# EAGLE design rf_switch (EAGLE 6.6.0)

## Sheet 1 of 2
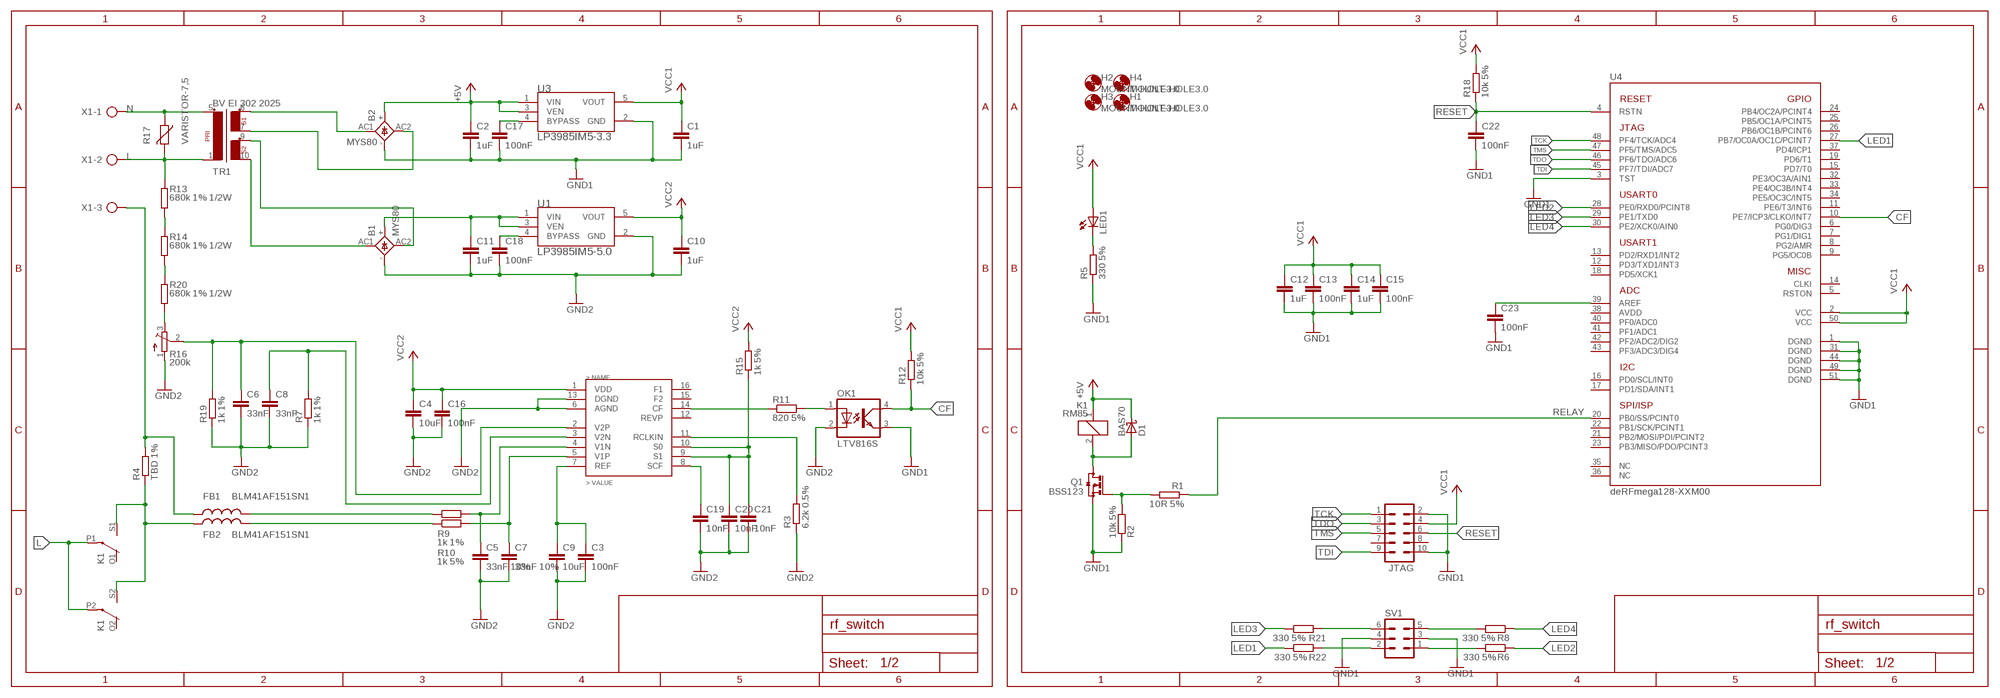
[diagram p0: schematic, sheet 1]

### Parts
B1  MYS80  [MICRODIL]
B2  MYS80  [MICRODIL]
C1  1uF  C-EUC0603  [C0603]
C2  1uF  C-EUC0603  [C0603]
C3  100nF  C-EUC0603  [C0603]
C4  10uF  C-EUC0805  [C0805]
C5  33nF 10%  C-EUC0805  [C0805]
C6  33nF  C-EUC0603  [C0603]
C7  33nF 10%  C-EUC0805  [C0805]
C8  33nF  C-EUC0603  [C0603]
C9  10uF  C-EUC0805  [C0805]
C10  1uF  C-EUC0603  [C0603]
C11  1uF  C-EUC0603  [C0603]
C12  1uF  C-EUC0603  [C0603]
C13  100nF  C-EUC0603  [C0603]
C14  1uF  C-EUC0603  [C0603]
C15  100nF  C-EUC0603  [C0603]
C16  100nF  C-EUC0603  [C0603]
C17  100nF  C-EUC0603  [C0603]
C18  100nF  C-EUC0603  [C0603]
C19  10nF  C-EUC0603  [C0603]
C20  10nF  C-EUC0603  [C0603]
C21  10nF  C-EUC0603  [C0603]
C22  100nF  C-EUC0603  [C0603]
C23  100nF  C-EUC0603  [C0603]
D1  BAS70  [SOT23]
FB1  BLM41AF151SN1  FERRITE-BEAD  [1806]
FB2  BLM41AF151SN1  FERRITE-BEAD  [1806]
H1  MOUNT-HOLE3.0  [3,0]
H2  MOUNT-HOLE3.0  [3,0]
H3  MOUNT-HOLE3.0  [3,0]
H4  MOUNT-HOLE3.0  [3,0]
JTAG  MA05-2  [MA05-2]
K1  RM85  4052  [F4052]
LED1  LEDSML0603  [SML0603]
OK1  LTV816S  [SMD4]
Q1  BSS123  [SOT23]
R1  10R 5%  R-EU_R0603  [R0603]
R2  10k 5%  R-EU_R0603  [R0603]
R3  6.2k 0.5%  R-EU_R0603  [R0603]
R4  TBD 1%  R-EU_R1206  [R1206]
R5  330 5%  R-EU_R0603  [R0603]
R6  330 5%  R-EU_R0603  [R0603]
R7  1k 1%  R-EU_R0603  [R0603]
R8  330 5%  R-EU_R0603  [R0603]
R9  1k 1%  R-EU_R1206  [R1206]
R10  1k 5%  R-EU_R1206  [R1206]
R11  820 5%  R-EU_R0603  [R0603]
R12  10k 5%  R-EU_R0603  [R0603]
R13  680k 1% 1/2W  R-EU_R1206  [R1206]
R14  680k 1% 1/2W  R-EU_R1206  [R1206]
R15  1k 5%  R-EU_R0603  [R0603]
R16  200k  TRIM_EU-3223W  [3223W]
R17  VARISTOR-7,5  [R-7,5]
R18  10k 5%  R-EU_R0603  [R0603]
R19  1k 1%  R-EU_R0603  [R0603]
R20  680k 1% 1/2W  R-EU_R1206  [R1206]
R21  330 5%  R-EU_R0603  [R0603]
R22  330 5%  R-EU_R0603  [R0603]
SV1  MA03-2  [MA03-2]
TR1  BV EI 302 2025  EI30-2  [EI30-2]
U1  LP3985IM5-5.0  LP3985IM5-3.3  [SOT95P300X120-5N]
U2  ADE7757  [SOIC-16]
U3  LP3985IM5-3.3  [SOT95P300X120-5N]
U4  DERFMEGA128-XXM00  [A-M00]
X1  AK500/3  [AK500/3]

### Nets
+5V: B2.+ C2.1 D1.3(C) K1.1 U3.1(VIN) U3.3(VEN)
CF: OK1.4(COL) R12.1 U4.10(PE7/ICP3/CLKO/INT7)
CF1: C20.1 C21.1 R15.1 U2.9(S1) U2.10(S0)
COMMON: FB1.P$1 R4.2 X1.3
GND1: B2.- C1.2 C2.2 C12.2 C13.2 C14.2 C15.2 C17.2 C22.2 C23.2 JTAG.2 JTAG.10 OK1.3(EMIT) Q1.2(S) R2.1 R5.1 SV1.3 SV1.4 U3.2(GND) U4.1(DGND) U4.3(TST) U4.31(DGND) U4.44(DGND) U4.49(DGND) U4.51(DGND)
GND2: B1.- C3.2 C4.2 C5.2 C6.2 C7.2 C8.2 C9.2 C10.2 C11.2 C16.2 C18.2 C19.2 C20.2 C21.2 OK1.2(C) R3.1 R7.1 R16.1(A) R19.1 U1.2(GND) U2.6(AGND) U2.13(DGND)
L: K1.P1(2:P) K1.P2(3:P) R13.1 R17.2 TR1.1 X1.2
LED1: R22.1 U4.27(PB7/OC0A/OC1C/PCINT7)
LED2: R6.1 U4.28(PE0/RXD0/PCINT8)
LED3: R21.1 U4.29(PE1/TXD0)
LED4: R8.1 U4.30(PE2/XCK0/AIN0)
N: R17.1 TR1.5 X1.1
N$1: Q1.1(G) R1.2 R2.2
N$2: B1.+ C11.1 U1.1(VIN) U1.3(VEN)
N$3: R11.1 U2.14(CF)
N$4: R13.2 R14.1
N$5: OK1.1(A) R11.2
N$6: D1.1(A) K1.2 Q1.3(D)
N$7: R14.2 R20.1
N$8: R3.2 U2.11(RCLKIN)
N$9: C19.1 U2.8(SCF)
N$10: FB1.P$2 R9.1
N$11: R16.3(E) R20.2
N$12: C3.1 C9.1 U2.7(REF)
N$13: B2.AC2 TR1.7
N$14: C23.1 U4.39(AREF)
N$15: FB2.P$1 K1.S1(2:S) K1.S2(3:S) R4.1
N$16: FB2.P$2 R10.1
N$17: B1.AC1 TR1.10
N$18: B1.AC2 TR1.9
N$19: R8.2 SV1.5
N$20: B2.AC1 TR1.6
N$23: LED1.C R5.2
N$24: C17.1 U3.4(BYPASS)
N$25: C18.1 U1.4(BYPASS)
N$26: R21.2 SV1.6
N$27: R22.2 SV1.2
N$28: R6.2 SV1.1
RELAY: R1.1 U4.20(PB0/SS/PCINT0)
RESET: C22.1 JTAG.6 R18.1 U4.4(RSTN)
TCK: JTAG.1 U4.48(PF4/TCK/ADC4)
TDI: JTAG.9 U4.45(PF7/TDI/ADC7)
TDO: JTAG.3 U4.46(PF6/TDO/ADC6)
TMS: JTAG.5 U4.47(PF5/TMS/ADC5)
V1N: C5.1 R9.2 U2.4(V1N)
V1P: C7.1 R10.2 U2.5(V1P)
V2N: C8.1 R7.2 U2.3(V2N)
V2P: C6.1 R16.2(S) R19.2 U2.2(V2P)
VCC1: C1.1 C12.1 C13.1 C14.1 C15.1 JTAG.4 LED1.A R12.2 R18.2 U3.5(VOUT) U4.2(VCC) U4.50(VCC)
VCC2: C4.1 C10.1 C16.1 R15.2 U1.5(VOUT) U2.1(VDD)
Unconnected: JTAG.7 JTAG.8 K1.O1(2:O) K1.O2(3:O) U2.12(REVP) U2.15(F2) U2.16(F1) U4.5(RSTON) U4.6(PG0/DIG3) U4.7(PG1/DIG1) U4.8(PG2/AMR) U4.9(PG5/OC0B) U4.11(PE6/T3/INT6) U4.12(PD3/TXD1/INT3) U4.13(PD2/RXD1/INT2) U4.14(CLKI) U4.15(PD7/T0) U4.16(PD0/SCL/INT0) U4.17(PD1/SDA/INT1) U4.18(PD5/XCK1) U4.19(PD6/T1) U4.21(PB2/MOSI/PDI/PCINT2) U4.22(PB1/SCK/PCINT1) U4.23(PB3/MISO/PDO/PCINT3) U4.24(PB4/OC2A/PCINT4) U4.25(PB5/OC1A/PCINT5) U4.26(PB6/OC1B/PCINT6) U4.32(PE3/OC3A/AIN1) U4.33(PE4/OC3B/INT4) U4.34(PE5/OC3C/INT5) U4.35(NC) U4.36(NC) U4.37(PD4/ICP1) U4.38(AVDD) U4.40(PF0/ADC0) U4.41(PF1/ADC1) U4.42(PF2/ADC2/DIG2) U4.43(PF3/ADC3/DIG4)

## Sheet 2 of 2

## Library data of the parts
B1 B2 = WB:MYS80: DIOTEC SEMICONDUCTOR
C1-C23 = rcl:C-EU: CAPACITOR, European symbol
D1 = diode:BAS70: Silicon Schottky Diodes General-purpose diode for high-speed switching
FB1 FB2 = WB:FERRITE-BEAD
H1-H4 = holes:MOUNT-HOLE: MOUNTING HOLE with drill center marker
JTAG = con-lstb:MA05-2: PIN HEADER; OC_FARNELL: unknown; OC_NEWARK: unknown
K1 = relay:4052: RELAY 2 x switch, Finder; OC_FARNELL: unknown; OC_NEWARK: unknown
LED1 = led:LED: LED OSRAM: - CHIPLED LG R971, LG N971, LY N971, LG Q971, LY Q971, LO R971, LY R971 LH N974, LH R974 LS Q976, LO Q976, LY Q976 LO Q996 - Hyper CHIPLED LW Q18S LB Q993, LB Q99A, LB R99A - SideLED LS A670, LO A670, LY A670, LG A670, LP A670 LB A673, LV A673, LT A673, LW A673 LH A674 LY A675 LS A676, LA A676, LO A676, LY A676, LW A676 LS A679, LY A679, LG A679 - Hyper Micro SIDELED® LS Y876, LA Y876, LO Y876, LY Y876 LT Y87S - SmartLED LW L88C, LW L88S LB L89C, LB L89S, LG L890 LS L89K, LO L89K, LY L89K LS L896, LA L896, LO L896, LY L896 - TOPLED LS T670, LO T670, LY T670, LG T670, LP T670 LSG T670, LSP T670, LSY T670, LOP T670, LYG T670 LG T671, LOG T671, LSG T671 LB T673, LV T673, LT T673, LW T673 LH T674 LS T676, LA T676, LO T676, LY T676, LB T676, LH T676, LSB T676, LW T676 LB T67C, LV T67C, LT T67C, LS T67K, LO T67K, LY T67K, LW E67C LS E67B, LA E67B, LO E67B, LY E67B, LB E67C, LV E67C, LT E67C LW T67C LS T679, LY T679, LG T679 LS T770, LO T770, LY T770, LG T770, LP T770 LB T773, LV T773, LT T773, LW T773 LH T774 LS E675, LA E675, LY E675, LS T675 LS T776, LA T776, LO T776, LY T776, LB T776 LHGB T686 LT T68C, LB T68C - Hyper Mini TOPLED® LB M676 - Mini TOPLED Santana® LG M470 LS M47K, LO M47K, LY M47K Source: http://www.osram.convergy.de LUXEON: - LUMILED® LXK2-PW12-R00, LXK2-PW12-S00, LXK2-PW14-U00, LXK2-PW14-V00 LXK2-PM12-R00, LXK2-PM12-S00, LXK2-PM14-U00 LXK2-PE12-Q00, LXK2-PE12-R00, LXK2-PE12-S00, LXK2-PE14-T00, LXK2-PE14-U00 LXK2-PB12-K00, LXK2-PB12-L00, LXK2-PB12-M00, LXK2-PB14-N00, LXK2-PB14-P00, LXK2-PB14-Q00 LXK2-PR12-L00, LXK2-PR12-M00, LXK2-PR14-Q00, LXK2-PR14-R00 LXK2-PD12-Q00, LXK2-PD12-R00, LXK2-PD12-S00 LXK2-PH12-R00, LXK2-PH12-S00 LXK2-PL12-P00, LXK2-PL12-Q00, LXK2-PL12-R00 Source: www.luxeon.com KINGBRIGHT: KA-3528ASYC Source: www.kingbright.com
OK1 = optocoupler:LTV816: OPTO COUPLER Source: LITEON, LTV816.pdf; OC_FARNELL: unknown; OC_NEWARK: unknown
Q1 = transistor-small-signal:BSS123: N-CHANNEL MOS FET
R1-R15 R18-R22 = rcl:R-EU_: RESISTOR, European symbol
R16 = pot:TRIM_EU-: POTENTIOMETER
R17 = varistor:VARISTOR: VARISTOR
SV1 = con-lstb:MA03-2: PIN HEADER; OC_FARNELL: unknown; OC_NEWARK: unknown
TR1 = trafo:EI30-2: TRANSFORMER 1 primary winding, 2 secondary windings ERA
U1 U3 = v-reg-3:LP3985IM5-3.3: Low-Dropout CMOS Voltage Regulator; MPN: LP3985IM5-3.3; OC_FARNELL: 1469025; OC_NEWARK: 23K8224; PACKAGE: SOT-5; SUPPLIER: NationalSemiconductor
U2 = analog:ADE7757
U4 = deRFmodules:DERFMEGA128-XXM00: deRFmega128 IEEE 802.15.4 Low Power Wireless Radio Module Microcontroller: Atmel ATmega128RFA1 Transceiver: integrated Manufacturer: dresden elektronik ingenieurtechnik gmbh Website: http://www.dresden-elektronik.de
X1 = con-ptr500:AK500/3: CONNECTOR; OC_FARNELL: unknown; OC_NEWARK: unknown

## Board
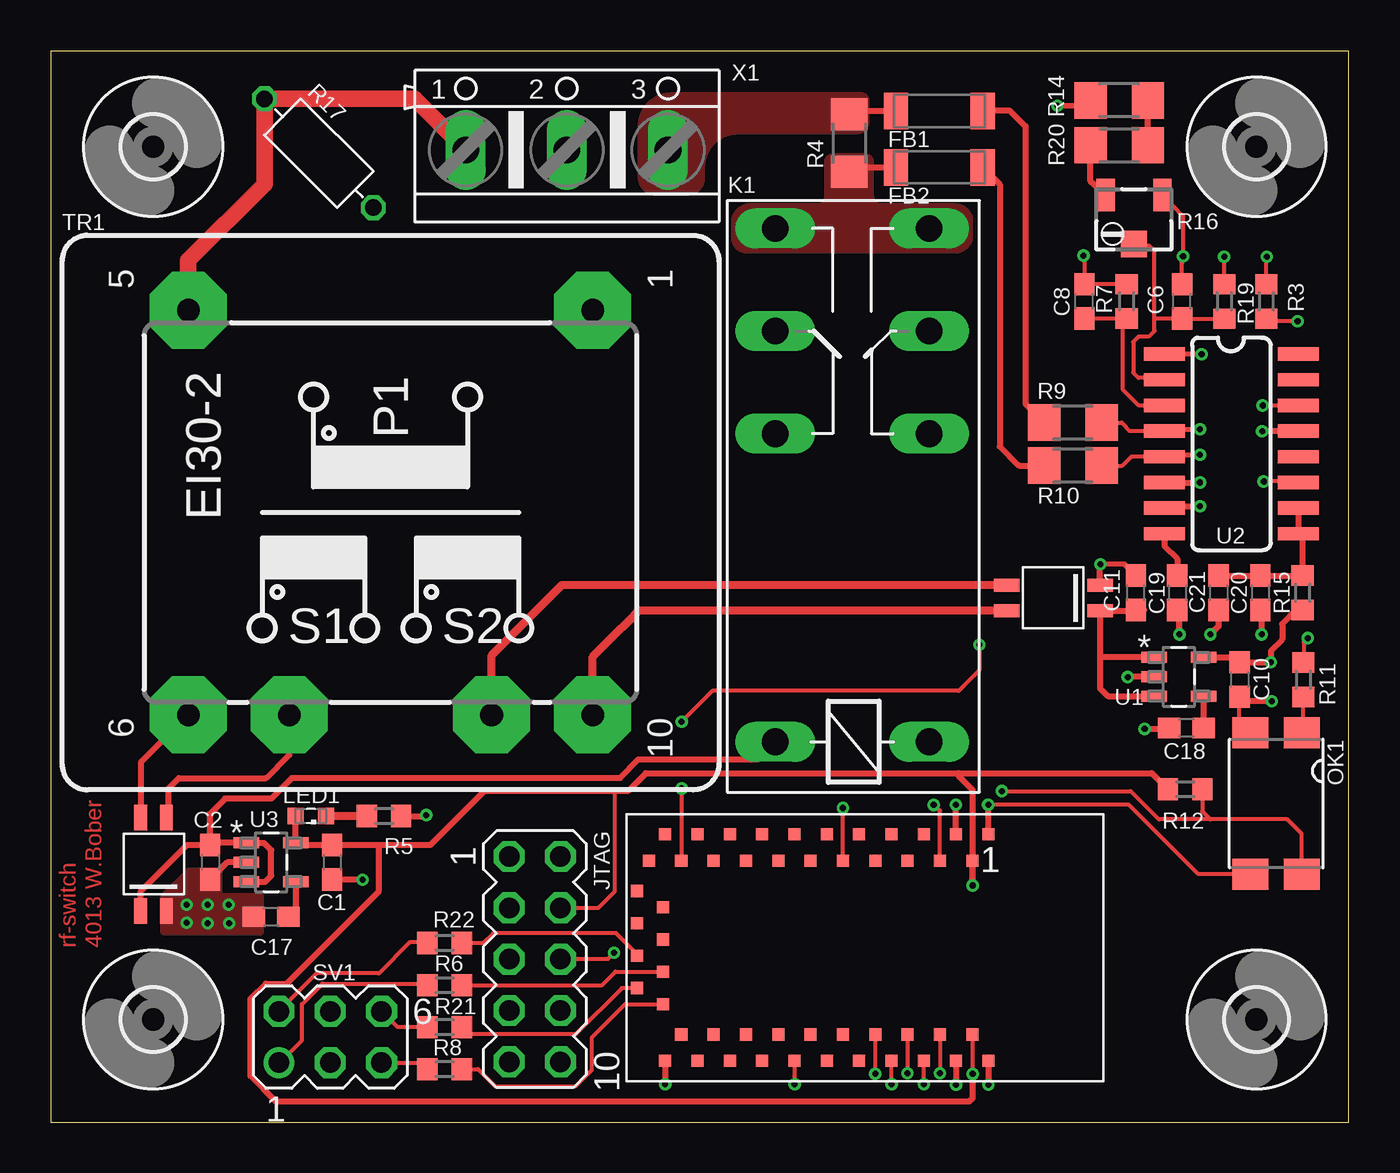
[diagram p1: board, top side]
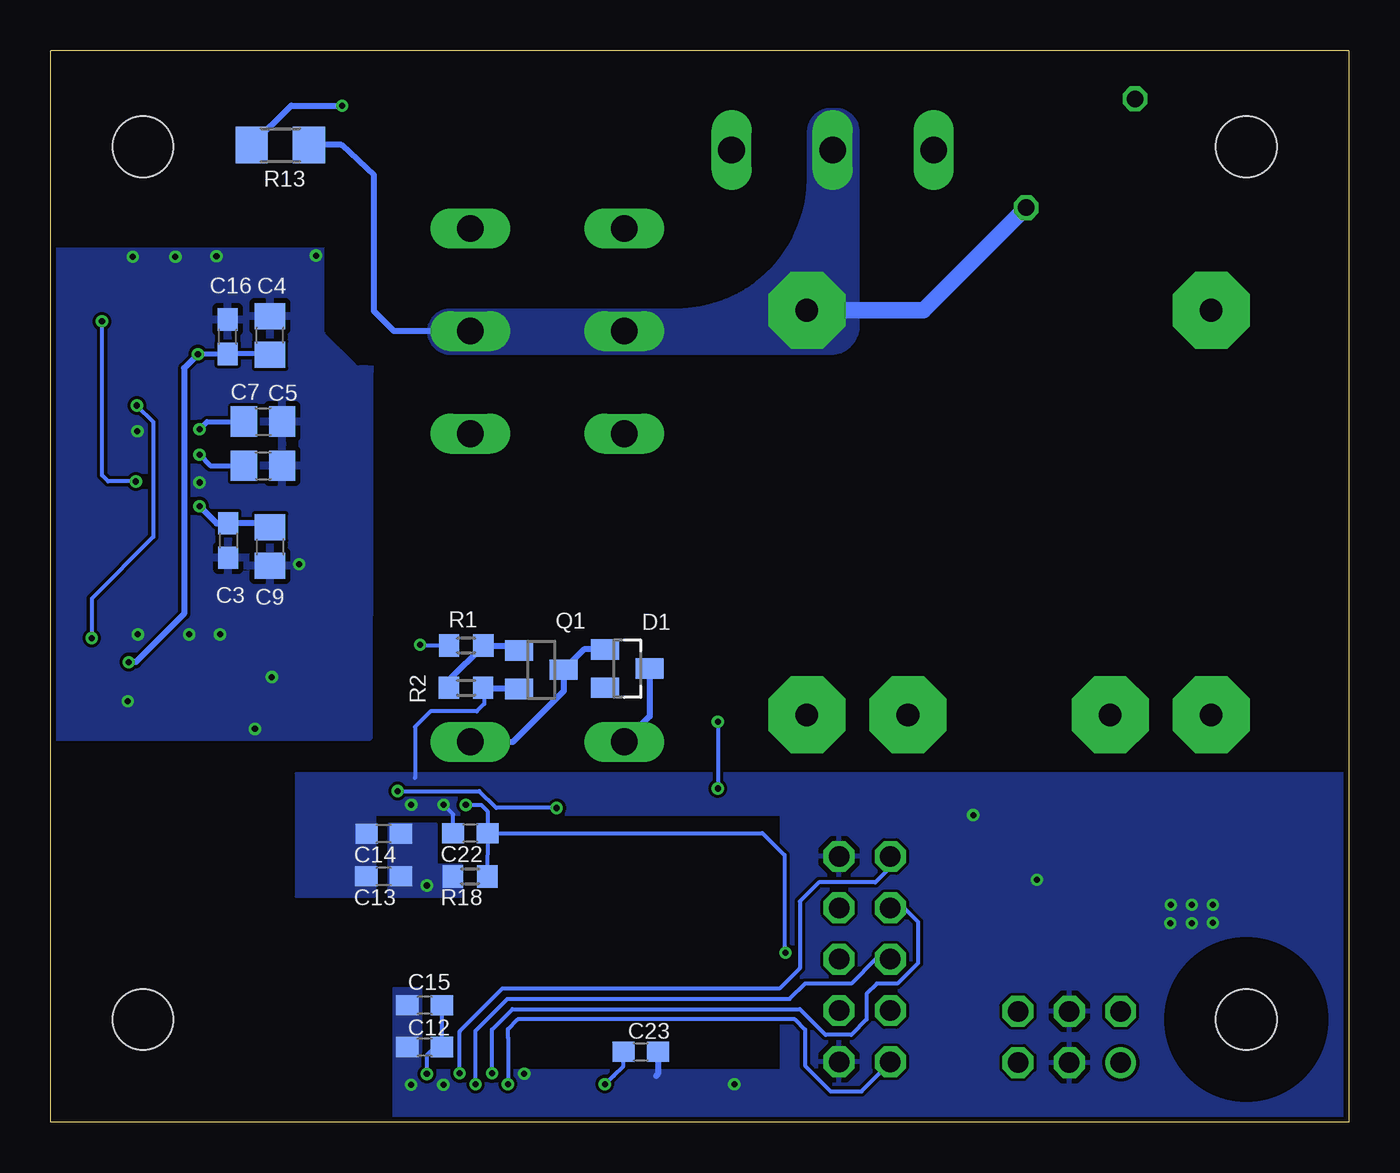
[diagram p2: board, bottom side, seen from below]

Size 64.27 x 53.02 mm. Coordinates in mm from the lower left corner, seen from the top.
Outline: 64.27,53 64.27,0 0,0 0,53
Outline: 0,53.02 64.27,53.02
Copper layers (1*2*15*16): Top 0.035mm / dielectric 0.2mm / layer 2 0.0175mm / dielectric 1.1mm / layer 15 0.0175mm / dielectric 0.2mm / Bottom 0.035mm
Design rules "default": minimum track width 6mil, minimum drill 12mil, track to track 6mil, track to pad 6mil, pad to pad 6mil, via to via 6mil, smd to smd 0mil, copper to edge 10mil, drill to drill 10mil, minimum pad ring 6mil, minimum via ring 6mil, stop-mask expansion 2mil, vias tented up to drill 25mil, thermal gap 10mil
bRestrict: 3 lines

### Footprints (pad centres in the part's own frame; a part is rotated, then mirrored left to right if it is on the bottom)
MICRODIL = smd 0.635 x 1.27: + 0.85,-0.83; - 2.12,-0.83; AC1 0.85,3.8; AC2 2.12,3.8
C0603 = smd 1.1 x 1: 1 -0.85,0; 2 0.85,0
C0805 = smd 1.3 x 1.5: 1 -0.95,0; 2 0.95,0
SOT23 = smd 1 x 1.4: 1 -0.95,-1.1; 2 0.95,-1.1; 3 0,1.1
1806 = smd 1.2 x 1.8: P$1 -2.1,0; P$2 2.2,0
3,0 = hole 3: 0,0
MA05-2 = drill 1.016 octagon: 1 -5.08,-1.27; 2 -5.08,1.27; 3 -2.54,-1.27; 4 -2.54,1.27; 5 0,-1.27; 6 0,1.27; 7 2.54,-1.27; 8 2.54,1.27; 9 5.08,-1.27; 10 5.08,1.27
F4052 = drill 1.321 long: 1 -3.81,3.81; 2 -3.81,-3.81; O1 11.43,-3.81; O2 11.43,3.81; P1 16.51,-3.81; P2 16.51,3.81; S1 21.59,-3.81; S2 21.59,3.81
SML0603 = smd 0.8 x 0.8: A 0.75,0; C -0.75,0
SMD4 = smd 1.78 x 1.55: 1 -1.27,-3.5; 2 1.27,-3.5; 3 1.27,3.5; 4 -1.27,3.5
R0603 = smd 1 x 1.1: 1 -0.85,0; 2 0.85,0
R1206 = smd 1.6 x 1.803: 1 -1.422,0; 2 1.422,0
3223W = smd 0.9 x 1.6: 1 -1.4,-1.215; 3 1.4,-1.215 | smd 1.3 x 1.3: 2 0,1.215
R-7,5 = drill 0.813 octagon: 1 -3.81,0; 2 3.81,0
MA03-2 = drill 1.016: 1 -2.54,-1.27 | drill 1.016 octagon: 2 -2.54,1.27; 3 0,-1.27; 4 0,1.27; 5 2.54,-1.27; 6 2.54,1.27
EI30-2 = drill 1.118 pad 3.81 octagon: 1 -10.008,10.008; 5 -10.008,-10.008; 6 10.008,-10.008; 7 10.008,-5.004; 9 10.008,5.004; 10 10.008,10.008
SOT95P300X120-5N = smd 1.27 x 0.559: 1 -1.219,0.965; 2 -1.219,0; 3 -1.219,-0.965; 4 1.219,-0.965; 5 1.219,0.965
SOIC-16 = smd 0.66 x 2.032: 1 -7.685,-3.285; 2 -6.415,-3.285; 3 -5.145,-3.285; 4 -3.875,-3.285; 5 -2.605,-3.285; 6 -1.335,-3.285; 7 -0.065,-3.285; 8 1.205,-3.285; 9 1.205,3.345; 10 -0.065,3.345; 11 -1.335,3.345; 12 -2.605,3.345; 13 -3.875,3.345; 14 -5.145,3.345; 15 -6.415,3.345; 16 -7.685,3.345
A-M00 = smd 0.6 x 0.6: 1 -6.1,-5.6; 2 -5.3,-4.3; 3 -4.5,-5.6; 4 -3.7,-4.3; 5 -2.9,-5.6; 6 -2.1,-4.3; 7 -1.3,-5.6; 8 -0.5,-4.3; 9 0.3,-5.6; 10 1.1,-4.3; 11 1.9,-5.6; 12 2.7,-4.3; 13 3.5,-5.6; 14 4.3,-4.3; 15 5.1,-5.6; 16 5.9,-4.3; 17 6.7,-5.6; 18 7.5,-4.3; 19 8.3,-5.6; 20 9.1,-4.3; 21 9.9,-5.6; 22 10.7,-4.3; 23 11.3,-2.8; 24 10,-2; 25 11.3,-1.2; 26 10,-0.4; 27 11.3,0.4; 28 10,1.2; 29 11.3,2; 30 10,2.8; 31 9.9,5.6; 32 9.1,4.3; 33 8.3,5.6; 34 7.5,4.3; 35 6.7,5.6; 36 5.9,4.3; 37 5.1,5.6; 38 4.3,4.3; 39 3.5,5.6; 40 2.7,4.3; 41 1.9,5.6; 42 1.1,4.3; 43 0.3,5.6; 44 -0.5,4.3; 45 -1.3,5.6; 46 -2.1,4.3; 47 -2.9,5.6; 48 -3.7,4.3; 49 -4.5,5.6; 50 -5.3,4.3; 51 -6.1,5.6
AK500/3 = drill 1.321 long: 1 -5.004,0; 2 0,0; 3 5.004,0

### Placement (x,y rotation side)
B1  51.12,24.45 90 top
B2  3.62,11.27 0 top
C1  13.94,12.86 270 top
C2  7.91,12.86 270 top
C3  55.47,28.78 270 bottom
C4  53.4,38.93 90 bottom
C5  53.75,34.66 0 bottom
C6  56.01,40.61 90 top
C7  53.75,32.48 0 bottom
C8  51.17,40.61 90 top
C9  53.4,28.48 270 bottom
C10  58.85,21.9 270 top
C11  53.72,26.19 90 top
C12  45.75,3.71 180 bottom
C13  47.78,12.16 180 bottom
C14  47.78,14.27 180 bottom
C15  45.75,5.78 180 bottom
C16  55.5,38.86 90 bottom
C17  10.92,10.16 180 top
C18  56.22,19.51 180 top
C19  55.77,26.19 270 top
C20  59.88,26.19 270 top
C21  57.81,26.19 270 top
C22  43.49,14.3 180 bottom
C23  35.05,3.48 0 bottom
D1  35.72,22.44 270 bottom
FB1  43.94,50.04 0 top
FB2  43.94,47.24 0 top
H1  5.08,48.26 0 top
H2  59.69,48.26 0 top
H3  5.08,5.08 0 top
H4  59.69,5.08 0 top
JTAG  23.97,8.06 270 top
K1  39.69,22.63 90 top
LED1  12.89,15.14 180 top
OK1  60.66,15.77 180 top
Q1  39.97,22.38 270 bottom
R1  43.69,23.58 0 bottom
R2  43.71,21.49 180 bottom
R3  60.18,40.61 270 top
R4  39.53,48.44 90 top
R5  16.51,15.14 180 top
R6  19.51,6.78 180 top
R7  53.26,40.61 270 top
R8  19.51,2.62 180 top
R9  50.61,34.61 0 top
R10  50.61,32.48 0 top
R11  62.01,21.89 270 top
R12  56.16,16.47 180 top
R13  52.9,48.35 180 bottom
R14  52.9,50.56 0 top
R15  61.98,26.19 270 top
R16  53.63,44.67 180 top
R17  13.29,47.94 315 top
R18  43.5,12.16 180 bottom
R19  58.1,40.61 270 top
R20  52.9,48.34 180 top
R21  19.51,4.7 180 top
R22  19.51,8.86 180 top
SV1  13.84,4.22 0 top
TR1  16.83,30.16 270 top
U1  55.85,22.03 0 top
U2  58.42,30.32 270 top
U3  10.92,12.86 0 top
U4  40.32,8.64 180 top
X1  25.56,48.1 0 top

### Tracks (layer width: path | path; a pad name or v marks a point on that pad's centre or on a via)
+5V
  Top 0.305: B2.+ 4.47,11.43 6.75,13.71 C2.1 7.91,13.82 U3.1 10.56,13.82 10.92,13.46 10.92,12.19 10.62,11.89 U3.3 | 7.87,13.74 7.87,15.24 8.64,16 10.92,16 11.94,17.02 28.19,17.02 29.08,17.93 34.99,17.93 K1.1
  Top 0.406: 7.87,13.74 C2.1
  Bottom 0.305: D1.3 34.62,20.08 K1.1
CF  (via drill 0.3)
  Top 0.203: U4.10 v39.22,15.54 | OK1.4 61.93,14.27 61.21,14.99 57.4,14.99 | 57.4,14.99 54.86,14.99 53.47,16.38 v47.09,16.38 | R12.1 57.01,15.38 57.4,14.99
  Bottom 0.203: v39.22,15.54 42.22,15.54 43.05,16.38 v47.09,16.38
CF1
  Top 0.305: C21.1 C20.1 R15.1 61.98,28.91 U2.9 | 61.85,29.03 U2.9 | U2.10 U2.9
COMMON
  Top 0.305: R4.2 39.7,50.04 FB1.P$1
  pour Top (no thermals): 40.13,50.8 30.73,50.8 arc90 29.21,49.28 29.21,46.79 arc91 30.04,45.96 31.49,45.99 31.51,45.99 arc90 32.26,46.74 32.26,47.24 arc-90 34.04,49.02 39.88,49.02 arc90 40.39,49.53 40.39,50.55 arc90
GND1  (via drill 0.3 pad 0.6)
  Top 0.203: v40.82,2.4 U4.44 | U4.44 | OK1.3 56.82,12.27 53.38,15.7 v46.41,15.7
  Top 0.305: U3.2 8.76,12.86 C2.2 | v15.45,11.99 13.95,12 C1.2 | R5.1 18.55,15.14 v18.6,15.2 | U4.31 v30.42,1.87 | U4.49 v44.82,1.85 v44.83,1.85 | U4.51 v46.42,1.85 | U4.3 44.82,15.54 v44.81,15.7 | U4.1 46.42,15.57 v46.41,15.7
  Bottom 0.203: C22.2 44.34,15.23 v44.81,15.7 | 42.8,21.43 42.8,20.7 43.18,20.32 45.47,20.32 46.23,19.56 46.23,17.02
  Bottom 0.305: C23.2 34.2,2.37 34.29,2.29 | Q1.2 42.8,21.43 R2.1
  other vias: 6.74,10.75 6.74,9.86 8.82,10.75 8.85,9.84 7.78,10.75 7.78,9.84
  pour Bottom (rank 2): 0,0 28.07,0 28.07,17.24 0,17.24
  pour Bottom: 24.13,15.24 52.07,15.24 52.07,17.24 24.13,17.24
  pour Top (no thermals): 8.38,12.45 6.86,12.45 5.59,11.18 5.59,9.4 10.41,9.4 10.41,11.18 8.38,11.18
  pour Bottom: 26.92,0 47.24,0 47.24,2.54 26.92,2.54
  pour Bottom (no thermals): 48.26,16 48.26,11.18 52.07,11.18 52.07,16
  pour Bottom (no thermals): 47.24,1.52 47.24,6.6 45.97,6.6 45.97,1.52
GND2  (via drill 0.3 pad 0.6)
  Top 0.203: R19.1 58.1,42.56 v58.09,42.82 | R3.1 60.18,42.55 v60.2,42.82 | C6.2 56.01,42.52 v56.06,42.85 56.06,44.82 R16.1 | R7.1 C8.2 51.17,42.57 v51.13,42.88 | OK1.2 58.85,19.81 C10.2
  Top 0.254: C11.2 53.16,27.61 v51.97,27.61
  Top 0.305: U1.2 53.33,22.04 v53.31,22.02 | v55.88,24.13 55.88,25.28 C19.2 | v59.94,24.13 59.94,25.28 C20.2 | v54.15,19.46 55.32,19.46 C18.2 | 58.93,20.98 C10.2 59.08,20.83 v60.45,20.83 | B1.- 51.95,27.59 v51.97,27.61 | U2.13 61.76,34.19 v59.97,34.19 | U2.6 55.14,31.65 v56.9,31.65 | C21.2 57.81,24.54 v57.4,24.13
  pour Bottom: 48.51,19.05 63.98,19.05 63.98,43.08 48.48,43.08
L
  Bottom 0.305: K1.P1 47.27,39.14 48.26,40.13 48.26,46.86 49.87,48.35 R13.1
  Bottom 0.813: R17.2 21.06,40.17 TR1.1
  pour Bottom (no thermals): 25.4,50.04 arc90 24.38,49.02 24.38,39.37 arc90 25.65,38.1 37.08,38.1 43.94,38.1 44.45,38.1 arc90 45.47,39.12 arc90 44.45,40.13 33.27,40.13 arc-90 26.67,46.74 26.67,49.02 arc90 25.65,50.04
LED1
  Top 0.203: U4.27 29.02,8.32 27.99,9.35 21.92,9.35 21.44,8.87 R22.1
LED2
  Top 0.203: R6.1 27.3,6.78 27.96,7.44 U4.28
LED3
  Top 0.203: U4.29 28.28,6.64 25.98,4.34 20.71,4.34 R21.1
LED4
  Top 0.203: R8.1 21.15,2.62 22,1.78 25.98,1.78 26.8,2.59 26.8,4.19 28.45,5.84 U4.30
N
  Top 0.813: TR1.5 6.82,42.63 10.59,46.41 R17.1 18.02,50.63 X1.1
N$1
  Bottom 0.305: Q1.1 41.32,23.58 R1.2 44.56,21.87 R2.2
N$2
  Top 0.305: 54.13,25.34 C11.1 53.93,25.3 B1.+ 51.95,23.11 | 51.95,23.11 51.95,21.46 52.32,21.08 54.62,21.08 U1.3 | U1.1 52.06,23 51.95,23.11
N$3  (via drill 0.3 pad 0.6)
  Top 0.203: 61.77,35.46 v59.99,35.46 | R11.1 62.03,22.75 62.03,23.75 v62.23,23.95
  Top 0.305: 61.77,35.46 U2.14 62.6,35.47
  Bottom 0.203: v59.99,35.46 59.18,34.65 59.18,28.96 62.23,25.91 v62.23,23.95
N$4  (via drill 0.3 pad 0.6)
  Top 0.305: v49.84,50.29 51.47,50.3 R14.1
  Bottom 0.305: R13.2 52.35,50.29 v49.84,50.29
N$5
  Top 0.203: OK1.1 62.01,19.35 R11.2
N$6
  Bottom 0.305: D1.1 37.87,23.39 Q1.3 38.87,21.32 41.38,18.82 K1.2
N$7
  Top 0.305: R20.1 R14.2
N$8  (via drill 0.3 pad 0.6)
  Top 0.203: U2.11 61.72,31.7 v60.05,31.7 | v61.72,39.62 60.31,39.62 R3.2
  Bottom 0.203: v60.05,31.7 61.42,31.7 61.72,32 v61.72,39.62
N$9
  Top 0.305: U2.8 55.13,28.51 55.77,27.88 C19.1
N$10
  Top 0.305: R9.1 48.26,35.53 48.26,49.28 47.5,50.04 FB1.P$2
N$11
  Top 0.305: R16.3 51.47,46.56 R20.2
N$12  (via drill 0.3 pad 0.6)
  Top 0.305: U2.7 55.23,30.48 v56.9,30.48
  Bottom 0.305: v56.9,30.48 56.05,29.63 C3.1 53.4,29.63 C9.1
N$13
  Top 0.305: TR1.7 11.82,18.17 10.67,17.02 6.35,17.02 5.84,16.51 5.84,15.17 B2.AC2
N$14  (via drill 0.3 pad 0.6)
  Top 0.203: U4.39 36.82,2.29 v36.83,1.88
  Bottom 0.203: v36.83,1.88 36.4,2.29 35.92,2.77 35.92,3.47 C23.1
N$15
  Top 0.305: R4.1 39.75,47.24 FB2.P$1
  pour Top (no thermals): 38.73,47.81 arc90 38.42,47.49 38.42,45.81 arc-90 37.94,45.33 34.61,45.33 arc90 33.81,44.54 33.81,43.75 arc90 34.45,43.11 44.77,43.11 arc90 45.56,43.9 45.56,44.54 arc90 44.77,45.33 41.12,45.33 arc-90 40.64,45.81 40.64,47.49 arc90 40.32,47.81
N$16
  Top 0.305: R10.1 47.94,32.48 46.99,33.43 46.99,46.4 FB2.P$2
N$17
  Top 0.406: B1.AC1 29.11,25.3 28.57,24.77 27.94,24.13 26.84,23.02 TR1.10
N$18
  Top 0.406: B1.AC2 25.3,26.57 23.5,24.77 22.86,24.13 21.83,23.1 TR1.9
N$19
  Top 0.203: SV1.5 18.33,2.95 R8.2
N$20
  Top 0.305: TR1.6 4.47,17.8 B2.AC1
N$23
  Top 0.406: R5.2 LED1.C
N$24
  Top 0.305: U3.4 12.14,10.16 C17.1
N$25
  Top 0.305: U1.4 C18.1
N$26
  Top 0.203: R21.2 17.17,4.7 SV1.6
N$27
  Top 0.203: R22.2 18.63,8.89 17.78,8.89 16.26,7.37 13.18,7.37 SV1.2
N$28
  Top 0.203: SV1.1 11.33,2.95 12.45,4.06 12.45,5.84 13.46,6.86 18.57,6.86 R6.2
RELAY  (via drill 0.3)
  Top 0.203: v45.97,23.62 45.97,22.35 44.96,21.34 32.77,21.34 v31.24,19.81 | v31.24,16.51 31.24,12.96 U4.20
  Bottom 0.203: R1.1 45.94,23.58 v45.97,23.62 | v31.24,19.81 v31.24,16.51
RESET  (via drill 0.3 pad 0.6)
  Top 0.203: U4.4 44.02,15.41 v43.71,15.7 | v27.89,8.38 27.57,8.06 JTAG.6
  Bottom 0.203: C22.1 42.64,14.28 R18.1 | C22.1 29.03,14.3 27.94,13.21 27.94,8.43 v27.89,8.38 | v43.71,15.7 42.95,15.7 42.65,15.39 C22.1
TCK  (via drill 0.3 pad 0.6)
  Top 0.203: 43.99,4.34 U4.48 v44.02,2.42 v44.02,2.41
  Bottom 0.203: JTAG.1 22.7,12.61 23.44,11.86 26.24,11.86 27.18,10.92 27.18,7.62 28.19,6.6 41.91,6.6 44.02,4.5 v44.02,2.41
TDI  (via drill 0.3 pad 0.6)
  Top 0.203: 41.66,3.04 U4.45 v41.63,1.88
  Bottom 0.203: v41.63,1.88 41.63,4.19 41.63,4.6 41.15,5.08 27.43,5.08 26.92,4.57 26.92,2.79 25.65,1.52 24.13,1.52 22.7,2.95 JTAG.9
TDO  (via drill 0.3 pad 0.6)
  Top 0.203: U4.46 v42.42,2.42 v42.42,2.41
  Bottom 0.203: v42.42,2.41 42.42,4.57 41.4,5.59 27.18,5.59 25.91,4.32 24.64,4.32 23.88,5.08 23.88,6.35 23.37,6.86 22.35,6.86 21.34,7.87 21.34,9.91 22.04,10.6 JTAG.3
TMS  (via drill 0.3 pad 0.6)
  Top 0.203: v43.23,1.88 43.23,3.03 U4.47
  Bottom 0.203: JTAG.5 23.43,8.06 24.64,6.86 26.92,6.86 27.69,6.1 41.66,6.1 43.23,4.52 v43.23,1.88
V1N  (via drill 0.3 pad 0.6)
  Top 0.203: R9.2 53.02,34.61 53.43,34.2 U2.4
  Top 0.254: U2.4 55.23,34.29 v56.9,34.29
  Bottom 0.254: v56.9,34.29 56.52,34.66 C5.1
V1P  (via drill 0.3 pad 0.6)
  Top 0.203: R10.2 53.05,32.48 53.5,32.93 U2.5
  Top 0.254: R10.2 52.57,32.26 52.58,32.26 | U2.5 55.23,33.02 v56.9,33.02
  Bottom 0.254: v56.9,33.02 56.36,32.48 C7.1
V2N
  Top 0.203: U2.3 55.13,35.46 53.87,35.46 53.09,36.25 53.09,39.59 R7.2 C8.1
V2P
  Top 0.203: U2.2 55.04,36.83 53.85,36.83 53.59,37.08 53.59,38.61 53.85,38.86 54.36,38.86 54.63,39.14 54.63,39.76 | 54.63,39.76 54.63,43.1 54.38,43.36 53.64,43.36 R16.2 | R19.2 C6.1 54.63,39.76
VCC1  (via drill 0.3, 0.3 pad 0.6)
  Top 0.203: v45.64,2.39 45.64,4.32 | JTAG.4 27.11,10.6 27.94,11.43 27.94,16.41
  Top 0.305: LED1.A U3.5 12.14,13.71 C1.1 16.26,13.71 | 16.26,13.71 18.79,13.71 21.49,16.41 27.94,16.41 28.6,16.41 29.46,17.27 44.96,17.27 | U4.50 45.64,4.32 | U4.2 45.62,11.73 v45.64,11.71 45.64,16.43 44.96,17.12 44.96,17.27 | v45.64,2.39 45.64,1.19 45.47,1.02 11.18,1.02 9.91,2.29 9.91,6.1 10.67,6.86 11.68,6.86 16.26,11.43 16.26,13.71 | 44.96,17.27 54.51,17.27 R12.2
  Bottom 0.203: v45.64,2.39 45.64,3.3 45.23,3.71 C12.1 C15.1
  Bottom 0.305: C13.1
  pour Bottom (no thermals): 45.21,11.18 47.5,11.18 47.5,14.73 45.21,14.73
  pour Bottom (no thermals): 45.21,12.7 43.94,12.7 43.94,11.18 45.97,11.18 45.97,12.7
VCC2  (via drill 0.3 pad 0.6)
  Top 0.254: v56.97,38 v56.96,38.01 U2.1
  Top 0.305: U1.5 58.6,23 C10.1 v60.39,22.75 v60.4,22.76 60.4,23.32 60.96,23.88 60.96,24.64 61.67,25.34 R15.2
  Bottom 0.254: C4.1 53.44,38.01 C16.1 55.51,38 v56.97,38
  Bottom 0.305: v56.97,38 57.66,37.31 57.66,25.15 60.05,22.76 v60.4,22.76

### Text on the board
Top: rf-switch | 4013 W.Bober